# Altium schematic sheet FPGA_POWER.SchDoc (part 2 of 3)
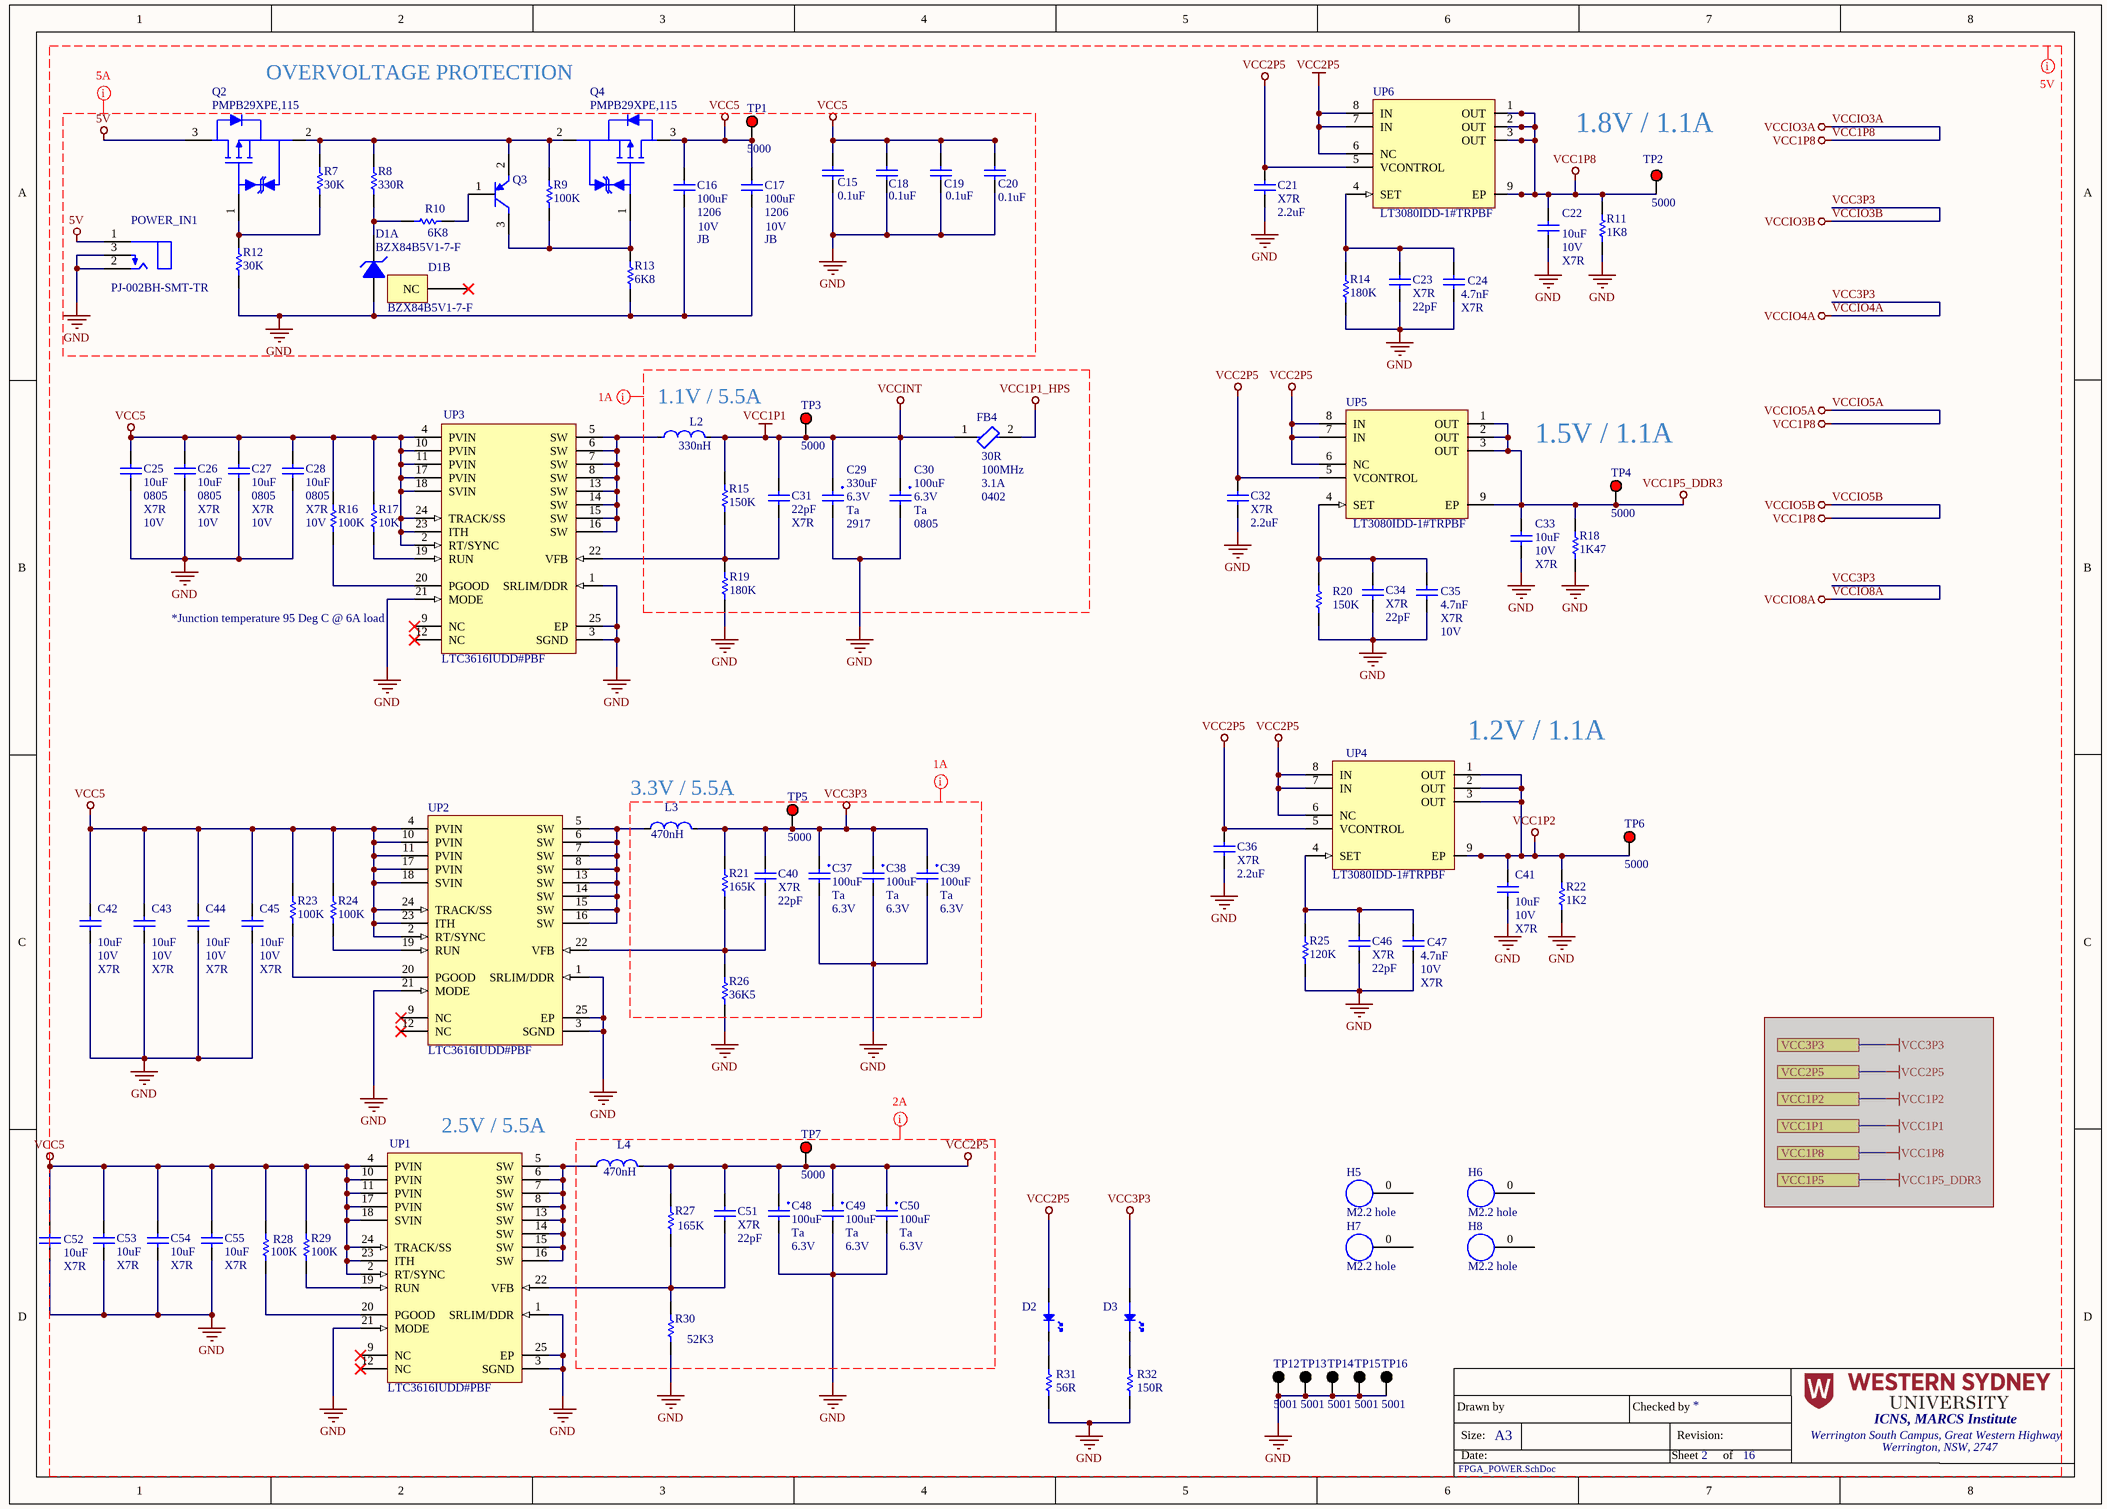
[diagram p1: FPGA_POWER.SchDoc]
## Library data of the parts
C15 C18-C20 = CMP-003-000005-1: Cap Ceramic 0.1uF 10V X7R 20% SMD 0402 125°C Paper T/R; Manufacturer 1: KEMET; Capacitance: 100nF; Dissipation Factor: 5%; Manufacturer Part Number 1: C0402C104M8RACTU; Stock 1: 32450; Pricing 1: 1=0.00400, 25=0.00400, 100=0.00400, 250=0.00400, 500=0.00400, 1000=0.00400 (USD); RoHS: Yes; Mount: Surface Mount; Case/Package: 0402; Case Code (Metric): 1005; Case Code (Imperial): 0402; Min Operating Temperature: -55°C; Max Operating Temperature: 125°C; Tolerance: 20%; Packaging: Tape and Reel; Package Quantity: 10000; Voltage Rating: 10V; Length: 1mm; Height: 0.5mm; Width: 0.02inch; Thickness: 0.022inch; Depth: 0.5mm; Radiation Hardening: No; ComponentLink1URL: https://datasheet.ciiva.com/26948/getdatasheetpartid-791262-26948427.pdf?src-supplier=Verical; ComponentLink1Description: https://datasheet.ciiva.com/26948/getdatasheetpartid-791262-26948427.pdf?src-supplier=Verical; Category: Ceramic Capacitors; Dielectric Material: Ceramic; Voltage Rating (DC): 10V; Dielectric: X7R; Termination: SMD/SMT; Series: C; RoHS Compliant: Yes; Source: ICNS_PropheseeLib.SchLib; Description 1: Cap Ceramic 0.1uF 10V X7R 20% SMD 0402 125°C Paper T/R; Lead Pitch: 0.3mm; Design Item ID: C0402C104M8RACTU
C16 C17 = CMP-003-000006-2: Cap Ceramic 100uF 10 V JB ±20 % Tolerance SMT 1206 Multilayer Ceramic Capacitor C Series; Manufacturer 1: TDK; Tolerance: 20%; Description 1: C Series 1206 100 uF 10 V ±20 % Tolerance JB SMT Multilayer Ceramic Capacitor; Manufacturer Part Number 1: C3216JB1A107M160AC; Stock 1: 4001; Pricing 1: 1=1.27730 (USD); RoHS: Yes; Mount: Surface Mount; Case Code (Imperial): 1206; Case Code (Metric): 3216; Dielectric Material: Ceramic; Min Operating Temperature: -25°C; Max Operating Temperature: 85°C; Packaging: Tape and Reel; Package Quantity: 2000; Capacitance: 100uF; Voltage Rating (DC): 10V; Termination: SMD/SMT; Resistor Type: Ceramic; Length: 0.126inch; Height: 1.6mm; Width: 0.063inch; Thickness: 0.069inch; Lead Free: Lead Free; ComponentLink1URL: https://datasheet.ciiva.com/14887/tdkmlcccaprange-14887077.pdf?src-supplier=Digi-Key; ComponentLink1Description: https://datasheet.ciiva.com/14887/tdkmlcccaprange-14887077.pdf?src-supplier=Digi-Key; ComponentLink2URL: https://datasheet.ciiva.com/14887/tdkmlcccaprange-14887078.pdf?src-supplier=Digi-Key; ComponentLink2Description: https://datasheet.ciiva.com/14887/tdkmlcccaprange-14887078.pdf?src-supplier=Digi-Key; ComponentLink3URL: https://datasheet.ciiva.com/14887/tdkmlcccaprange-14887079.pdf?src-supplier=Digi-Key; ComponentLink3Description: https://datasheet.ciiva.com/14887/tdkmlcccaprange-14887079.pdf?src-supplier=Digi-Key; Source: ICNS_PropheseeLib.SchLib; Category: Ceramic Capacitors; Design Item ID: C3216JB1A107M160AC; Series: C; RoHS Compliant: Yes
C21 C32 C36 = CMP-003-000007-1: Multilayer Ceramic Capacitor 0402 10V X7R 2.2uf 10%Tol paper; Manufacturer: Murata; Voltage Rating: 10V; Category: Ceramic Capacitors; Pricing: 1=0.24000, 10=0.16300, 50=0.09760, 100=0.08230, 500=0.05634, 1000=0.04984, 2500=0.04767, 5000=0.04334 (USD); Stock: 1230; RoHS Compliant: Yes; RoHS: Yes; Source: ICNS_PropheseeLib.SchLib; Case Code Imperial: 0402; Design Item ID: GRM155Z71A225KE01D; Manufacturer Part Number: GRM155Z71A225KE01D
C22 C25-C28 C33 C41-C45 = CMP-003-000011-1: Cap Multilayer Ceramic 10 uF 10 V X7R ±10 % 0805 Surface Mount Capacitor; Manufacturer: Murata; Tolerance: 10%; RoHS: Yes; Mount: Surface Mount; Case/Package: 0805; Weight: 0.000335oz; Case Code (Metric): 2012; Min Operating Temperature: -55°C; Max Operating Temperature: 125°C; Capacitance: 10uF; Packaging: Tape and Reel; Termination: SMD/SMT; Voltage Rating (DC): 10V; Package Quantity: 10000; Length: 0.079inch; Height: 1.25mm; Width: 1.25mm; Thickness: 0.055inch; ComponentLink1URL: http://www.mouser.com/ds/2/281/c03e-806517.pdf?src-supplier=Mouser; ComponentLink1Description: http://www.mouser.com/ds/2/281/c03e-806517.pdf?src-supplier=Mouser; Category: Ceramic Capacitors; Design Item ID: GCM21BR71A106KE22K; Ratings: AEC-Q200; ComponentLink3URL: http://search.murata.co.jp/Ceramy/image/img/A01X/partnumbering_e_02.pdf?src-supplier=Digi-Key; ComponentLink4Description: http://search.murata.co.jp/Ceramy/image/img/A01X/G101/ENG/GCM21BR71A106KE22-01.pdf?src-supplier=Digi-Key; RoHS Compliant: Yes; Manufacturer Part Number: GCM21BR71A106KE22K; ComponentLink2Description: https://search.murata.co.jp/Ceramy/image/img/A01X/G101/ENG/GCM21BR71A106KE22-01.pdf?src-supplier=Digi-Key; ComponentLink2URL: https://search.murata.co.jp/Ceramy/image/img/A01X/G101/ENG/GCM21BR71A106KE22-01.pdf?src-supplier=Digi-Key; Source: ICNS_PropheseeLib.SchLib; Pricing: 1=0.45000, 10=0.31600, 50=0.23880, 100=0.20790, 500=0.15400, 1000=0.13090, 2500=0.12320, 5000=0.11550 (USD); Stock: 4655; ComponentLink4URL: http://search.murata.co.jp/Ceramy/image/img/A01X/G101/ENG/GCM21BR71A106KE22-01.pdf?src-supplier=Digi-Key; ComponentLink3Description: http://search.murata.co.jp/Ceramy/image/img/A01X/partnumbering_e_02.pdf?src-supplier=Digi-Key
  C22 C33 C41-C45: Case Code (Imperial): 0805
C23 C31 C34 C40 C46 C51 = CMP-003-000033-1: Cap Ceramic 22pF 50V X7R 10% Pad SMD 0402 125C T/R; Manufacturer: KEMET; Capacitance: 22pF; Min Operating Temperature: -55°C; Voltage Rating (DC): 50V; Max Operating Temperature: 125°C; Packaging: Tape and Reel; Dielectric Material: Ceramic; Case/Package: 0402; Tolerance: 10%; RoHS Compliant: Yes; Termination: Wraparound; Length: 1mm; Depth: 0.5mm; Lead Free: Lead Free; Category: Ceramic Capacitors; Stock 1: 5829; Pricing 1: 1=0.18000, 10=0.12600, 25=0.10400, 50=0.08100, 100=0.05900 (USD); Manufacturer Part Number: C0402C220K5RACTU; Design Item ID: C0402C220K5RACTU; RoHS: Yes; Source: ICNS_PropheseeLib.SchLib
C24 C35 C47 = CMP-003-000003-1: Multilayer Ceramic Capacitor 0.0047uF 10V 10% 0402 Paper T/R; Manufacturer: Taiyo Yuden; RoHS: Yes; Capacitance: 4.7nF; Manufacturer Part Number: LMF105B7472KVHF; Case Code Imperial: 0402; Stock: 10371; Design Item ID: LMF105B7472KVHF; Category: Ceramic Capacitors; Pricing: 1=0.10000, 10=0.05600, 50=0.03040, 100=0.02480, 500=0.01772, 1000=0.01392, 2500=0.01265, 5000=0.01164 (USD); RoHS Compliant: Yes; Source: ICNS_PropheseeLib.SchLib
  C24: Voltage Rating: 10V
C29 = CMP-003-000008-1: Cap Tant Solid 330uF 6.3V D CASE 10% (7.3 X 4.3 X 2.8mm) SMD 7343-31 0.1 Ohm 125 C T/R; Manufacturer 1: KEMET; Tolerance: 20%; Life (Hours): 2000Hour; Ripple Current: 490mA; ESR (Equivalent Series Resistance): 100mR; Dissipation Factor: 8%; Leakage Current: 20.8uA; Dielectric Material: Tantalum; Polarity: Polar; Radiation Hardening: No; ComponentLink2Description: https://datasheet.ciiva.com/18096/getdatasheetpartid-131544-18096133.pdf?src-supplier=Verical; Width: 0.169inch; ComponentLink2URL: https://datasheet.ciiva.com/18096/getdatasheetpartid-131544-18096133.pdf?src-supplier=Verical; Case/Package: 7343-31; Length: 7.3mm; Package Quantity: 1; Max Operating Temperature: 125°C; Height: 2.8mm; ComponentLink1URL: https://datasheet.ciiva.com/3006/kem-t2009-t495-3006066.pdf?src-supplier=Avnet; Mount: Surface Mount,PCB; Packaging: Tape and Reel; Capacitance: 330uF; ComponentLink1Description: https://datasheet.ciiva.com/3006/kem-t2009-t495-3006066.pdf?src-supplier=Avnet; Min Operating Temperature: -55°C; ComponentLink4Description: https://datasheet.ciiva.com/22698/1881875-22698950.pdf?src-supplier=Element14; Voltage Rating (DC): 6.3V; Category: Tantalum Capacitors; Features: General Purpose; ComponentLink4URL: https://datasheet.ciiva.com/22698/1881875-22698950.pdf?src-supplier=Element14; RoHS: Yes; Lead Pitch: 3.8mm; ComponentLink3URL: https://datasheet.ciiva.com/14603/70095916-14603941.pdf?src-supplier=Allied+Electronics; Case Code (Metric): 7343; Stock 1: 2500; Series: T495; Pricing 1: 1=2.57000, 10=2.07900, 50=1.81480, 100=1.58790 (USD); Manufacturer Part Number 1: T495D337K006ATE100; Voltage: 6.3V; Lead Free: Lead Free; Description 1: Cap Tant Solid 330uF 6.3V D CASE 10% (7.3 X 4.3 X 2.8mm) SMD 7343-31 0.1 Ohm 125 C T/R; Height - Seated (Max): 0.122inch; Number of Pins: 2; Termination: SMD/SMT; REACH SVHC: No SVHC; Design Item ID: T495D337K006ATE100; Source: ICNS_PropheseeLib.SchLib; RoHS Compliant: Yes; Construction: Flat; ComponentLink3Description: https://datasheet.ciiva.com/14603/70095916-14603941.pdf?src-supplier=Allied+Electronics; Depth: 4.3mm
C30 C37-C39 C48-C50 = CMP-003-000001-2: Cap Tant Solid 100uF 6.3V R CASE 20% (2 X 1.35 X 1.35mm) SMD 2012-15 5 Ohm 125°C Plastic T/R; Manufacturer 1: Kyocera AVX; ESR (Equivalent Series Resistance): 5R; Leakage Current: 6uA; Manufacturer Part Number 1: TLCR107M006RTA; Stock 1: 3919; Pricing 1: 1=2.74000, 10=2.21400, 50=1.93200, 100=1.69050, 500=1.28800, 1000=1.12700 (USD); RoHS: Yes; Mount: Surface Mount; Case/Package: 0805; Case Code (Metric): 2012; Min Operating Temperature: -55°C; Max Operating Temperature: 125°C; Tolerance: 20%; Package Quantity: 1; Packaging: Tape and Reel; Voltage Rating (DC): 6.3V; Termination: SMD/SMT; Features: General Purpose; Length: 2mm; Height: 1.5mm; Width: 0.053inch; Height - Seated (Max): 0.059inch; Depth: 1.35mm; Radiation Hardening: No; Lead Free: Lead Free; ComponentLink1URL: https://datasheet.ciiva.com/16299/tantniob-16299237.pdf?src-supplier=Future+Electronics; ComponentLink1Description: https://datasheet.ciiva.com/16299/tantniob-16299237.pdf?src-supplier=Future+Electronics; ComponentLink2URL: https://datasheet.ciiva.com/17337/tlc-17337857.pdf?src-supplier=Avnet+Europe; ComponentLink2Description: https://datasheet.ciiva.com/17337/tlc-17337857.pdf?src-supplier=Avnet+Europe; ComponentLink3URL: https://datasheet.ciiva.com/264/tlc-264930.pdf?src-supplier=Digi-Key; ComponentLink3Description: https://datasheet.ciiva.com/264/tlc-264930.pdf?src-supplier=Digi-Key; ComponentLink4URL: https://datasheet.ciiva.com/264/tlc-264931.pdf?src-supplier=Digi-Key; ComponentLink4Description: https://datasheet.ciiva.com/264/tlc-264931.pdf?src-supplier=Digi-Key; ComponentLink5URL: https://datasheet.ciiva.com/264/tlc-264932.pdf?src-supplier=Digi-Key; ComponentLink5Description: https://datasheet.ciiva.com/264/tlc-264932.pdf?src-supplier=Digi-Key; ComponentLink6URL: https://datasheet.ciiva.com/12882/tlc-4380-12882614.pdf?src-supplier=Mouser; ComponentLink6Description: https://datasheet.ciiva.com/12882/tlc-4380-12882614.pdf?src-supplier=Mouser; Capacitance: 100uF; Category: Tantalum Capacitors; Series: TLC; Construction: Flat; RoHS Compliant: Yes; Source: ICNS_PropheseeLib.SchLib; Description 1: Cap Tant Solid 100uF 6.3V R CASE 20% (2 X 1.35 X 1.35mm) SMD 2012-15 5 Ohm 125°C Plastic T/R; Design Item ID: TLCR107M006RTA
  C37-C39 C48-C50: Case Code (Imperial): 0805
C52-C55 = CMP-003-000011-1: 0805 10 uF 10 V ±10 % Tolerance X7R Surface Mount Multilayer Ceramic Capacitor; Manufacturer: Murata; Tolerance: 10%; Voltage Rating (DC): 10V; Capacitance: 10uF; Case/Package: 0805; Case Code (Imperial): 0805; Case Code (Metric): 2012; ComponentLink1Description: http://www.mouser.com/ds/2/281/c03e-806517.pdf?src-supplier=Mouser; ComponentLink1URL: http://www.mouser.com/ds/2/281/c03e-806517.pdf?src-supplier=Mouser; ComponentLink2Description: https://search.murata.co.jp/Ceramy/image/img/A01X/G101/ENG/GCM21BR71A106KE22-01.pdf?src-supplier=Digi-Key; ComponentLink2URL: https://search.murata.co.jp/Ceramy/image/img/A01X/G101/ENG/GCM21BR71A106KE22-01.pdf?src-supplier=Digi-Key; ComponentLink3Description: http://search.murata.co.jp/Ceramy/image/img/A01X/partnumbering_e_02.pdf?src-supplier=Digi-Key; ComponentLink3URL: http://search.murata.co.jp/Ceramy/image/img/A01X/partnumbering_e_02.pdf?src-supplier=Digi-Key; ComponentLink4Description: http://search.murata.co.jp/Ceramy/image/img/A01X/G101/ENG/GCM21BR71A106KE22-01.pdf?src-supplier=Digi-Key; ComponentLink4URL: http://search.murata.co.jp/Ceramy/image/img/A01X/G101/ENG/GCM21BR71A106KE22-01.pdf?src-supplier=Digi-Key; Height: 1.25mm; Length: 0.079inch; Max Operating Temperature: 125°C; Min Operating Temperature: -55°C; Mount: Surface Mount; Packaging: Tape and Reel; RoHS: Yes; Thickness: 0.055inch; Voltage Rating: 10V; Width: 1.25mm; Category: Ceramic Capacitors; Design Item ID: GCM21BR71A106KE22K; Ratings: AEC-Q200; Weight: 0.000335oz; Package Quantity: 10000; RoHS Compliant: Yes; Manufacturer Part Number: GCM21BR71A106KE22K; Source: ICNS_PropheseeLib.SchLib; Pricing: 1=0.45000, 10=0.31600, 50=0.23880, 100=0.20790, 500=0.15400, 1000=0.13090, 2500=0.12320, 5000=0.11550 (USD); Stock: 4655; Termination: SMD/SMT
D1 = CMP-004-000015-1: Diode Zener Single 5.1V 2% 350mW 3-Pin SOT-23 T/R; Manufacturer: Diodes; Max Reverse Current: 2uA; Test Current: 5mA; Impedance: 60R; ESD Protection: No; Forward Voltage: 900mV; ComponentLink1URL: https://datasheet.ciiva.com/30478/0900766b81268ba3-30478627.pdf?src-supplier=RSComponents; ComponentLink1Description: https://datasheet.ciiva.com/30478/0900766b81268ba3-30478627.pdf?src-supplier=RSComponents; RoHS: Yes; Mount: Surface Mount; Max Operating Temperature: 150°C; Max Power Dissipation: 350mW; Packaging: Tape and Reel; Tolerance: 2%; Case/Package: SOT-23; Package Quantity: 3000; Voltage Tolerance: 2%; REACH SVHC: No SVHC; Zener Voltage: 5.1V; Design Item ID: BZX84B5V1-7-F; Source: ICNS_PropheseeLib.SchLib; Max Reverse Leakage Current: 2uA; Category: Zener Diodes; Min Operating Temperature: -65°C; Element Configuration: Single; Number of Pins: 3; Weight: 0.00031oz; RoHS Compliant: Yes; Stock 1: 223; Contact Plating: Tin,Matte; Pricing 1: 1=0.17220, 10=0.16360, 25=0.16120, 100=0.09210 (USD); Lead Free: Lead Free; Power Rating: 350mW; Length: 2.9mm; Termination: SMD/SMT; Height: 1mm; Diode Type: ZENER; Zener Current: 2uA; Series: -; Manufacturer Part Number: BZX84B5V1-7-F; Width: 2.4mm
D2 D3 = CMP-004-000014-1: Led, Red, 630 Nm, 1.9 V, 20mA, 30 Ma, 60 Mcd Rohs Compliant: Yes; Manufacturer 1: Wurth Electronics; Wavelength: 630nm; Forward Voltage: 1.9V; Forward Current: 30mA; Lens Style: Clear,Rectangular; Luminous Intensity: 60mcd; Viewing Angle: 140°; Description 1: Led, Red, 630 Nm, 1.9 V, 30 Ma, 60 Mcd Rohs Compliant: Yes; Case/Package: 0603; Case Code (Metric): 1608; Width: 0.8mm; Height: 0.7mm; Case Code (Imperial): 0603; Min Operating Temperature: -40°C; Mount: Surface Mount; REACH SVHC: Unknown; Packaging: Tape and Reel; Color: Red; Test Current: 20mA; Max Operating Temperature: 85°C; Package Quantity: 4000; Dominant Wavelength: 630nm; Length: 1.6mm; RoHS Compliant: Yes; ComponentLink3Description: https://datasheet.ciiva.com/48430/150060ss75000-eng-tds-48430042.pdf?src-supplier=Distrelec; RoHS: Yes; Stock 1: 25645; Source: ICNS_PropheseeLib.SchLib; ComponentLink2Description: https://datasheet.ciiva.com/29279/759429-da-01-en-chipled-0603-w-kl-s-rot-150060ss75000-29279208.pdf?src-supplier=Conrad; ComponentLink1URL: https://datasheet.ciiva.com/23843/150060ss75000-23843248.pdf?src-supplier=Newark; Category: LEDs; ComponentLink3URL: https://datasheet.ciiva.com/48430/150060ss75000-eng-tds-48430042.pdf?src-supplier=Distrelec; ComponentLink1Description: https://datasheet.ciiva.com/23843/150060ss75000-23843248.pdf?src-supplier=Newark; Pricing 1: 1=0.15000, 50=0.13800, 100=0.11800, 500=0.10200 (USD); Design Item ID: 150060SS75000; ComponentLink2URL: https://datasheet.ciiva.com/29279/759429-da-01-en-chipled-0603-w-kl-s-rot-150060ss75000-29279208.pdf?src-supplier=Conrad; Manufacturer Part Number 1: 150060SS75000
FB4 = CMP-005-000017-1: Ferrite Beads Multi-Layer 30Ohm 25% 100MHz 3.1A 0.017Ohm DCR 0402 T/R; Manufacturer: Murata; Number of Lines: 1; DC Resistance (DCR): 17mR; Case Code (Metric): 1005; RoHS: Yes; Case/Package: 0402; ComponentLink1URL: https://www.murata.com/en-us/products/productdata/8796740059166/ENFA0018.pdf?src-supplier=Digi-Key; Source: ICNS_PropheseeLib.SchLib; Stock 1: 9104; Mount: Surface Mount; Max Operating Temperature: 125°C; Pricing 1: 1=0.11210, 10=0.07210, 100=0.04290, 500=0.04030, 10000=0.03340 (USD); Design Item ID: BLM15KD300SN1D; Min Operating Temperature: -55°C; Category: Ferrite Beads and Chips; Packaging: Cut Tape; RoHS Compliant: Yes; ComponentLink1Description: https://www.murata.com/en-us/products/productdata/8796740059166/ENFA0018.pdf?src-supplier=Digi-Key; Manufacturer Part Number: BLM15KD300SN1D
H5-H8 = CMP-019-000000-1: M2.2 through hole not plated; Source: ICNS_PropheseeLib.SchLib; Design Item ID: M2.2 hole
L2 = CMP-006-00022-1: Inductor High Current Shielded Wirewound 330nH 20% 100KHz 20A 3.9mOhm DCR 2525 T/R; DC Resistance (DCR): 3.9mR; Max DC Current: 30A; Self Resonant Frequency: 5MHz; Case/Package: 2525; Current Rating: 20A; Depth: 6.72mm; Height - Seated (Max): 0.118inch; Height: 3mm; Inductance: 330nH; Inductance Tolerance: 20%; Lead Free: Lead Free; Length: 6.86mm; Max Operating Temperature: 125°C; Min Operating Temperature: -55°C; Mount: Surface Mount; Number of Pins: 2; Package Quantity: 2000; Packaging: Tape and Reel; Radiation Hardening: No; REACH SVHC: Unknown; RMS Current (Irms): 20A; Saturation Current: 30A; Shielding: Shielded; Termination: SMD/SMT; Test Frequency: 100kHz; Tolerance: 20%; Width: 0.255inch; Case Code (Metric): 6363; Case Code (Imperial): 2525; Military Standard: Not; Series: IHLP-2525CZ-01; Rated Current-Max: 20A
L3 L4 = CMP-005-000001-1: Power Choke Shielded Wirewound 0.47uH 20% 100KHz Powdered Iron 17.5A 0.0042Ohm DCR 2525 T/R; Manufacturer 1: Vishay; DC Resistance (DCR): 4.2mR; Saturation Current: 26A; Self Resonant Frequency: 75MHz; Max Operating Temperature: 125°C; Shielding: Shielded; Tolerance: 20%; Inductance: 470nH; Current Rating: 17.5A; Min Operating Temperature: -55°C; Test Frequency: 100kHz; Mount: Surface Mount; Manufacturer Part Number 1: IHLP2525CZETR47M01; Source: ICNS_PropheseeLib.SchLib; Design Item ID: IHLP2525CZETR47M01; Description 1: Power Choke Shielded Wirewound 0.47uH 20% 100KHz Powdered Iron 17.5A 0.0042Ohm DCR 2525 T/R; Category: Fixed Inductors; Number of Pins: 2; Stock 1: 914; Inductance Tolerance: 20%; RoHS: Yes; Pricing 1: 1=1.31000, 10=1.21600, 25=1.12200, 50=0.93500, 100=0.87890, 250=0.78540, 500=0.67320 (USD)
POWER_IN1 = CMP-010-000001-1: Power Barrel Connector Jack 2.50mm ID (0.098"), 5.50mm OD (0.217") Surface Mount, Right Angle; Manufacturer: CUI; Shielding: Unshielded; Insulation Resistance: 100MR; Gender: Male; Voltage Rating: 24V; Number of Conductors: 2; Current Rating: 5A; Manufacturer Part Number: PJ-002BH-SMT-TR; Housing Material: Thermoplastic; Design Item ID: PJ-002BH-SMT-TR; Color: Black; Lead Free: Lead Free; Source: ICNS_PropheseeLib.SchLib; Packaging: Tape and Reel; RoHS: Yes; Category: Connectors; ComponentLink1URL: https://datasheet.ciiva.com/7359/pj-002bh-smt-7359045.pdf?src-supplier=Digi-Key; Connector Type: Jack; ComponentLink3URL: https://datasheet.ciiva.com/16478/pj-002bh-16478074.pdf?src-supplier=Future+Electronics; Package Quantity: 350; Mount: Surface Mount; ComponentLink3Description: https://datasheet.ciiva.com/16478/pj-002bh-16478074.pdf?src-supplier=Future+Electronics; Contact Gender: Male; Min Operating Temperature: -25°C; Contact Material: Copper Alloy,Brass; Series: -; Termination: SMD/SMT; Orientation: Horizontal; Housing Color: Black; Max Operating Temperature: 85°C; Flammability Rating: UL94 V-0; ComponentLink1Description: https://datasheet.ciiva.com/7359/pj-002bh-smt-7359045.pdf?src-supplier=Digi-Key; ComponentLink2Description: https://datasheet.ciiva.com/7359/pj-002bh-smt-7359048.pdf?src-supplier=Digi-Key; ComponentLink2URL: https://datasheet.ciiva.com/7359/pj-002bh-smt-7359048.pdf?src-supplier=Digi-Key; Contact Plating: Nickel
Q2 Q4 = CMP-008-000015-1: PMPB29XPE - 20 V, single P-channel Trench MOSFET; Manufacturer: Nexperia; RoHS Compliant: Yes; Source: ICNS_PropheseeLib.SchLib; Stock 1: 942; RoHS: Yes; Design Item ID: PMPB29XPE,115; Manufacturer Part Number: PMPB29XPE,115; Category: MOSFETs; Pricing 1: 1=0.45000, 10=0.38100, 100=0.28460, 500=0.22360, 1000=0.17279 (USD)
Q3 = CMP-007-000000-1: TRANS PNP 25V 1.5A SOT23; Manufacturer 1: MCC; Element Configuration: Single; Gain Bandwidth Product: 100MHz; Collector Emitter Voltage (VCEO): 500mV; hFE Min: 40; Max Power Dissipation: 625mW; Collector Base Voltage (VCBO): 40V; Emitter Base Voltage (VEBO): 1.6V; Manufacturer Part Number 1: MMSS8550-H-TP; Stock 1: 17326; Pricing 1: 1=0.20000, 10=0.17800, 100=0.09700, 500=0.05970, 1000=0.04070 (USD); RoHS: Yes; Mount: Surface Mount; Case/Package: SOT-23; Min Operating Temperature: -55°C; Max Operating Temperature: 150°C; Package Quantity: 1; Packaging: Tape and Reel; Max Collector Current: 1.5A; Transition Frequency: 100MHz; Collector Emitter Breakdown Voltage: 25V; Max Breakdown Voltage: 25V; Polarity: PNP; Collector Emitter Saturation Voltage: 500mV; Lead Free: Lead Free; ComponentLink1URL: https://datasheet.ciiva.com/16285/mmss8550sot-23-12703-16285519.pdf?src-supplier=Mouser; ComponentLink1Description: https://datasheet.ciiva.com/16285/mmss8550sot-23-12703-16285519.pdf?src-supplier=Mouser; ComponentLink2URL: https://datasheet.ciiva.com/17380/mmss8550sot-23-17380226.pdf?src-supplier=Future+Electronics; ComponentLink2Description: https://datasheet.ciiva.com/17380/mmss8550sot-23-17380226.pdf?src-supplier=Future+Electronics; ComponentLink3URL: https://datasheet.ciiva.com/6356/mmss8550sot-23-6356925.pdf?src-supplier=Digi-Key; ComponentLink3Description: https://datasheet.ciiva.com/6356/mmss8550sot-23-6356925.pdf?src-supplier=Digi-Key; ComponentLink4URL: https://datasheet.ciiva.com/6356/mmss8550sot-23-6356926.pdf?src-supplier=Digi-Key; ComponentLink4Description: https://datasheet.ciiva.com/6356/mmss8550sot-23-6356926.pdf?src-supplier=Digi-Key; ComponentLink5URL: https://datasheet.ciiva.com/6356/mmss8550sot-23-6356927.pdf?src-supplier=Digi-Key; ComponentLink5Description: https://datasheet.ciiva.com/6356/mmss8550sot-23-6356927.pdf?src-supplier=Digi-Key; Description 1: TRANS PNP 25V 1.5A SOT23; Source: ICNS_PropheseeLib.SchLib; Collector-emitter Voltage-Max: 500mV; Series: -; RoHS Compliant: Yes; Design Item ID: MMSS8550-H-TP; Category: BJTs
R7 R12 = CMP-006-000002-1: Res Thick Film 0402 30K Ohm 1% 0.2W(1/5W) ±100ppm/°C Chip Resistor Automotive AEC-Q200, Pulse Withstanding; Manufacturer 1: Vishay Dale; Max Power Dissipation: 200mW; Resistance: 30kR; Description 1: RES SMD 30K OHM 1% 1/5W 0402; RoHS: Yes; Case/Package: 0402; Min Operating Temperature: -55°C; Max Operating Temperature: 155°C; Tolerance: 1%; Number of Terminations: 2; Temperature Coefficient: 100ppm/°C; Width: 0.02inch; ComponentLink1URL: http://www.vishay.com/docs/20065/rcse3.pdf?src-supplier=Digi-Key; ComponentLink1Description: http://www.vishay.com/docs/20065/rcse3.pdf?src-supplier=Digi-Key; Manufacturer Part Number 1: RCS040230K0FKED; Stock 1: 1812; Pricing 1: 1=0.12000, 10=0.10500, 100=0.04020, 1000=0.01771, 2500=0.01530, 5000=0.01368 (USD); Packaging: Tape and Reel; Length: 0.039inch; Features: Automotive AEC-Q200; Height: 0.016inch; Package Quantity: 10000; Source: ICNS_PropheseeLib.SchLib; Resistor Type: Thick Film; Design Item ID: RCS040230K0FKED; Category: Chip SMD Resistors; RoHS Compliant: Yes
R8 = CMP-006-000013-1: Res Thick Film 0402 330 Ohm 1% 0.2W ±100ppm/°C Molded SMD SMD Paper T/R; Manufacturer 1: Vishay Dale; Max Power Dissipation: 200mW; Voltage Rating (DC): 50V; Power Rating: 125mW; RoHS: Yes; Mount: Surface Mount; Case/Package: 0402; Case Code (Metric): 1005; Case Code (Imperial): 0402; Min Operating Temperature: -55°C; Max Operating Temperature: 155°C; Tolerance: 1%; Number of Terminations: 2; Temperature Coefficient: 100ppm/°C; Width: 0.02inch; ComponentLink1URL: https://datasheet.ciiva.com/2573/crcwhpe3-2573979.pdf?src-supplier=Digi-Key; ComponentLink1Description: https://datasheet.ciiva.com/2573/crcwhpe3-2573979.pdf?src-supplier=Digi-Key; ComponentLink2URL: https://datasheet.ciiva.com/8944/crcwhpe3-8944953.pdf?src-supplier=Avnet; ComponentLink2Description: https://datasheet.ciiva.com/8944/crcwhpe3-8944953.pdf?src-supplier=Avnet; Manufacturer Part Number 1: CRCW0402330RFKEDHP; Stock 1: 5573; Pricing 1: 10000=0.01543 (USD); Number of Pins: 2; Resistance: 330R; Voltage Rating: 50V; Packaging: Tape and Reel; Package Quantity: 10000; Termination: SMD/SMT; Features: Automotive AEC-Q200; Length: 1mm; Height: 0.016inch; Depth: 0.5mm; REACH SVHC: Unknown; Lead Free: Lead Free; Contact Plating: Tin; Military Standard: Not; Radiation Hardening: No; Resistance Tolerance: 1%; Category: Chip SMD Resistors; Design Item ID: CRCW0402330RFKEDHP; Series: CRCW-HP; Technology: THICK FILM; Construction: Rectangular; Resistor Type: Thick Film; Description 1: Res Thick Film 0402 330 Ohm 1% 0.2W ±100ppm/°C Molded SMD SMD Paper T/R; RoHS Compliant: Yes; Source: ICNS_PropheseeLib.SchLib
R9 R16 R23 R24 R28 R29 = CMP-006-000009-1: Res Thick Film 0402 100K Ohm 1% 0.2W(1/5W) ±100ppm/C Pad SMD Automotive T/R; Manufacturer 1: Vishay Dale; Max Power Dissipation: 125mW; Temperature Coefficient: 100ppm/°C; Resistance: 100kR; Voltage Rating: 50V; RoHS: Yes; Mount: Surface Mount; Case/Package: 0402; Case Code (Metric): 1005; Case Code (Imperial): 0402; Min Operating Temperature: -55°C; Max Operating Temperature: 155°C; Tolerance: 1%; Number of Terminations: 2; Width: 0.02inch; ComponentLink1URL: https://datasheet.ciiva.com/2498/crcwhpe3-2498716.pdf?src-supplier=Digi-Key; ComponentLink1Description: https://datasheet.ciiva.com/2498/crcwhpe3-2498716.pdf?src-supplier=Digi-Key; ComponentLink2URL: https://datasheet.ciiva.com/2498/crcwhpe3-2498717.pdf?src-supplier=Digi-Key; ComponentLink2Description: https://datasheet.ciiva.com/2498/crcwhpe3-2498717.pdf?src-supplier=Digi-Key; ComponentLink3URL: https://datasheet.ciiva.com/2498/crcwhpe3-2498718.pdf?src-supplier=Digi-Key; ComponentLink3Description: https://datasheet.ciiva.com/2498/crcwhpe3-2498718.pdf?src-supplier=Digi-Key; Manufacturer Part Number 1: CRCW0402100KFKEDHP; Stock 1: 96553; Pricing 1: 10000=0.01543 (USD); Weight: 2.3E-05oz; Contact Plating: Tin; Features: Automotive AEC-Q200; Power Rating: 125mW; Packaging: Tape and Reel; Package Quantity: 10; Termination: SMD/SMT; Voltage Rating (DC): 50V; Length: 1mm; Height: 0.3mm; Depth: 0.5mm; Radiation Hardening: No; REACH SVHC: Unknown; Lead Free: Lead Free; ComponentLink4URL: https://datasheet.ciiva.com/8982/crcwhpe3-8982553.pdf?src-supplier=Avnet; ComponentLink4Description: https://datasheet.ciiva.com/8982/crcwhpe3-8982553.pdf?src-supplier=Avnet; ComponentLink5URL: https://datasheet.ciiva.com/48525/crcwhpe3-48525582.pdf?src-supplier=Avnet; ComponentLink5Description: https://datasheet.ciiva.com/48525/crcwhpe3-48525582.pdf?src-supplier=Avnet; ComponentLink6URL: https://datasheet.ciiva.com/5548/crcwhpe3-46056-5548557.pdf?src-supplier=Mouser; ComponentLink6Description: https://datasheet.ciiva.com/5548/crcwhpe3-46056-5548557.pdf?src-supplier=Mouser; ComponentLink7URL: https://datasheet.ciiva.com/46441/1703058-46441599.pdf?src-supplier=Element14; ComponentLink7Description: https://datasheet.ciiva.com/46441/1703058-46441599.pdf?src-supplier=Element14; Series: CRCW-HP; RoHS Compliant: Yes; Design Item ID: CRCW0402100KFKEDHP; Resistor Type: Thick Film; Resistance Tolerance: 1%; Description 1: Res Thick Film 0402 100K Ohm 1% 0.2W(1/5W) ±100ppm/C Pad SMD Automotive T/R; Source: ICNS_PropheseeLib.SchLib; Category: Chip SMD Resistors; Technology: THICK FILM
R10 R13 = CMP-006-000014-1: Res Thick Film 0402 6.8K Ohm 1% 0.2W(1/5W) ±100ppm/°C Pad SMD Automotive T/R; Manufacturer 1: Vishay Dale; Max Power Dissipation: 200mW; Voltage Rating (DC): 50V; Power Rating: 125mW; Resistance: 6.8kR; RoHS: Yes; Mount: Surface Mount; Case/Package: 0402; Case Code (Metric): 1005; Case Code (Imperial): 0402; Min Operating Temperature: -55°C; Max Operating Temperature: 155°C; Tolerance: 1%; Number of Terminations: 2; Temperature Coefficient: 100ppm/°C; Width: 0.02inch; ComponentLink1URL: https://datasheet.ciiva.com/2527/crcwhpe3-2527060.pdf?src-supplier=Digi-Key; ComponentLink1Description: https://datasheet.ciiva.com/2527/crcwhpe3-2527060.pdf?src-supplier=Digi-Key; ComponentLink2URL: https://datasheet.ciiva.com/2527/crcwhpe3-2527061.pdf?src-supplier=Digi-Key; ComponentLink2Description: https://datasheet.ciiva.com/2527/crcwhpe3-2527061.pdf?src-supplier=Digi-Key; ComponentLink3URL: https://datasheet.ciiva.com/2527/crcwhpe3-2527062.pdf?src-supplier=Digi-Key; ComponentLink3Description: https://datasheet.ciiva.com/2527/crcwhpe3-2527062.pdf?src-supplier=Digi-Key; Manufacturer Part Number 1: CRCW04026K80FKEDHP; Stock 1: 5018; Pricing 1: 1=0.15000, 10=0.13200, 100=0.05060, 1000=0.02226, 2500=0.01923, 5000=0.01720 (USD); Voltage Rating: 50V; Termination: SMD/SMT; Packaging: Cut Tape; Military Standard: Not; Package Quantity: 10000; Features: Automotive AEC-Q200; Length: 1mm; Height: 0.016inch; Depth: 0.5mm; REACH SVHC: Unknown; Lead Free: Lead Free; Category: Chip SMD Resistors; Description 1: Res Thick Film 0402 6.8K Ohm 1% 0.2W(1/5W) ±100ppm/°C Pad SMD Automotive T/R; Series: CRCW-HP; Resistance Tolerance: 1%; Technology: THICK FILM; Contact Plating: Tin; Design Item ID: CRCW04026K80FKEDHP; Construction: Rectangular; Number of Pins: 2; Resistor Type: Thick Film; Source: ICNS_PropheseeLib.SchLib; RoHS Compliant: Yes
R11 = CMP-006-000012-1: Res Thick Film 0402 1.8K Ohm 1% 0.2W(1/5W) ±100ppm/°C Pad SMD Automotive T/R; Manufacturer 1: Vishay Dale; Max Power Dissipation: 200mW; Resistance: 1.8kR; Power Rating: 125mW; Voltage Rating: 50V; RoHS: Yes; Mount: Surface Mount; Case/Package: 0402; Case Code (Metric): 1005; Case Code (Imperial): 0402; Min Operating Temperature: -55°C; Max Operating Temperature: 155°C; Tolerance: 1%; Number of Terminations: 2; Temperature Coefficient: 100ppm/°C; Width: 0.02inch; ComponentLink1URL: https://datasheet.ciiva.com/2573/crcwhpe3-2573155.pdf?src-supplier=Digi-Key; ComponentLink1Description: https://datasheet.ciiva.com/2573/crcwhpe3-2573155.pdf?src-supplier=Digi-Key; ComponentLink2URL: https://datasheet.ciiva.com/28420/crcwhpe3-28420126.pdf?src-supplier=Avnet+Europe; ComponentLink2Description: https://datasheet.ciiva.com/28420/crcwhpe3-28420126.pdf?src-supplier=Avnet+Europe; Manufacturer Part Number 1: CRCW04021K80FKEDHP; Stock 1: 10000; Pricing 1: 1=0.15000, 10=0.13200, 100=0.05060, 1000=0.02226, 2500=0.01923, 5000=0.01720 (USD); Contact Plating: Tin; Package Quantity: 10000; Packaging: Tape and Reel; Termination: SMD/SMT; Features: Automotive AEC-Q200; Military Standard: Not; Length: 1mm; Height: 0.016inch; Depth: 0.5mm; Radiation Hardening: No; Lead Free: Lead Free; Resistor Type: Thick Film; REACH SVHC: Unknown; Category: Chip SMD Resistors; Technology: THICK FILM; Voltage Rating (DC): 50V; Resistance Tolerance: 1%; Source: ICNS_PropheseeLib.SchLib; Construction: Rectangular; Description 1: Res Thick Film 0402 1.8K Ohm 1% 0.2W(1/5W) ±100ppm/°C Pad SMD Automotive T/R; Series: CRCW-HP; Number of Pins: 2; Design Item ID: CRCW04021K80FKEDHP; RoHS Compliant: Yes
R14 R19 = CMP-006-000001-1: Res Thick Film 0402 180K Ohm 1% 0.2W(1/5W) ±100ppm/°C Chip Resistor Automotive AEC-Q200, Pulse Withstanding; Manufacturer 1: Vishay Dale; Max Power Dissipation: 200mW; Resistance: 180kR; Description 1: RES SMD 180K OHM 1% 1/5W 0402; RoHS: Yes; Case/Package: 0402; Min Operating Temperature: -55°C; Max Operating Temperature: 155°C; Tolerance: 1%; Number of Terminations: 2; Temperature Coefficient: 100ppm/°C; Width: 0.02inch; ComponentLink1URL: http://www.vishay.com/docs/20065/rcse3.pdf?src-supplier=Digi-Key; ComponentLink1Description: http://www.vishay.com/docs/20065/rcse3.pdf?src-supplier=Digi-Key; Manufacturer Part Number 1: RCS0402180KFKED; Stock 1: 6251; Pricing 1: 1=0.12000, 10=0.10500, 100=0.04020, 1000=0.01771, 2500=0.01530, 5000=0.01368 (USD); Features: Automotive AEC-Q200; Package Quantity: 10000; Packaging: Tape and Reel; Length: 0.039inch; Height: 0.016inch; Resistor Type: Thick Film; Source: ICNS_PropheseeLib.SchLib; Design Item ID: RCS0402180KFKED; Category: Chip SMD Resistors; RoHS Compliant: Yes
R15 = CMP-006-000006-1: Res Thick Film 0402 150K Ohm 1% 1/16W ±100ppm/°C Molded SMD SMD Paper T/R; Manufacturer 1: Vishay; Max Power Dissipation: 63mW; Voltage Rating: 50V; Resistance: 150kR; RoHS: Yes; Mount: Surface Mount; Case/Package: 0402; Case Code (Metric): 1005; Case Code (Imperial): 0402; Min Operating Temperature: -55°C; Max Operating Temperature: 155°C; Tolerance: 1%; Number of Terminations: 2; Temperature Coefficient: 100ppm/°C; Width: 0.02inch; ComponentLink1URL: https://datasheet.ciiva.com/11809/0900766b80d98824-11809905.pdf?src-supplier=RSComponents; ComponentLink1Description: https://datasheet.ciiva.com/11809/0900766b80d98824-11809905.pdf?src-supplier=RSComponents; ComponentLink2URL: https://datasheet.ciiva.com/5545/dcrcwe3-109170-5545413.pdf?src-supplier=Mouser; ComponentLink2Description: https://datasheet.ciiva.com/5545/dcrcwe3-109170-5545413.pdf?src-supplier=Mouser; ComponentLink3URL: https://datasheet.ciiva.com/2463/dcrcwe3-2463136.pdf?src-supplier=Digi-Key; ComponentLink3Description: https://datasheet.ciiva.com/2463/dcrcwe3-2463136.pdf?src-supplier=Digi-Key; Manufacturer Part Number 1: CRCW0402150KFKED; Stock 1: 2100; Pricing 1: 50=0.06100, 500=0.05700, 1000=0.05100, 2000=0.04500, 4000=0.03900 (USD); Weight: 2.3E-05oz; Contact Plating: Tin; Packaging: Tape and Reel; Package Quantity: 10; Power Rating: 63mW; Termination: SMD/SMT; Military Standard: Not; Voltage Rating (DC): 50V; Features: Automotive AEC-Q200; Length: 1mm; Height: 0.35mm; Depth: 0.5mm; Radiation Hardening: No; REACH SVHC: Unknown; Lead Free: Lead Free; ComponentLink4URL: https://datasheet.ciiva.com/2463/dcrcwe3-2463137.pdf?src-supplier=Digi-Key; ComponentLink4Description: https://datasheet.ciiva.com/2463/dcrcwe3-2463137.pdf?src-supplier=Digi-Key; ComponentLink5URL: https://datasheet.ciiva.com/2463/dcrcwe3-2463138.pdf?src-supplier=Digi-Key; ComponentLink5Description: https://datasheet.ciiva.com/2463/dcrcwe3-2463138.pdf?src-supplier=Digi-Key; ComponentLink6URL: https://datasheet.ciiva.com/8336/dcrcwe3-8336669.pdf?src-supplier=Avnet; ComponentLink6Description: https://datasheet.ciiva.com/8336/dcrcwe3-8336669.pdf?src-supplier=Avnet; ComponentLink7URL: https://datasheet.ciiva.com/16207/dcrcwe3-16207433.pdf?src-supplier=Future+Electronics; ComponentLink7Description: https://datasheet.ciiva.com/16207/dcrcwe3-16207433.pdf?src-supplier=Future+Electronics; ComponentLink8URL: https://datasheet.ciiva.com/26316/fld-crcw-e3-data-en-26316632.pdf?src-supplier=Distrelec; ComponentLink8Description: https://datasheet.ciiva.com/26316/fld-crcw-e3-data-en-26316632.pdf?src-supplier=Distrelec; RoHS Compliant: Yes; Resistance Tolerance: 1%; Resistor Type: Thick Film; Description 1: Res Thick Film 0402 150K Ohm 1% 1/16W ±100ppm/°C Molded SMD SMD Paper T/R; Series: CRCW; Construction: Rectangular; Category: Chip SMD Resistors; Design Item ID: CRCW0402150KFKED; Working Voltage: 50V; Source: ICNS_PropheseeLib.SchLib; Technology: THICK FILM
R17 = CMP-006-000000-1: Res Thick Film 0402 10K Ohm 1% 0.2W(1/5W) ±100ppm/°C Pad SMD Automotive Medical T/R; Manufacturer 1: Vishay Dale; Max Power Dissipation: 200mW; Resistance: 10kR; RoHS: Yes; Case/Package: 0402; Case Code (Metric): 1005; Case Code (Imperial): 0402; Min Operating Temperature: -55°C; Max Operating Temperature: 155°C; Tolerance: 1%; Number of Terminations: 2; Temperature Coefficient: 100ppm/°C; Width: 0.02inch; ComponentLink1URL: http://www.farnell.com/datasheets/2869616.pdf?src-supplier=Farnell; ComponentLink1Description: http://www.farnell.com/datasheets/2869616.pdf?src-supplier=Farnell; ComponentLink2URL: http://www.vishay.com/docs/20065/rcse3.pdf?src-supplier=Digi-Key; ComponentLink2Description: http://www.vishay.com/docs/20065/rcse3.pdf?src-supplier=Digi-Key; ComponentLink3URL: http://www.farnell.com/datasheets/2869616.pdf?src-supplier=Newark; ComponentLink3Description: http://www.farnell.com/datasheets/2869616.pdf?src-supplier=Newark; Manufacturer Part Number 1: RCS040210K0FKED; Stock 1: 6361; Pricing 1: 1=0.12000, 10=0.10500, 100=0.04020, 1000=0.01771, 2500=0.01530, 5000=0.01368 (USD); Features: Automotive AEC-Q200; Packaging: Tape and Reel; Length: 0.039inch; Height: 0.016inch; Description 1: Res Thick Film 0402 10K Ohm 1% 0.2W(1/5W) ±100ppm/°C Pad SMD Automotive Medical T/R; Resistor Type: Thick Film; Design Item ID: RCS040210K0FKED; Source: ICNS_PropheseeLib.SchLib; Category: Chip SMD Resistors
R18 = CMP-006-000007-1: Res Thick Film 0402 1.47K Ohm 1% 1/16W ±100ppm/°C Molded SMD SMD Paper T/R; Manufacturer 1: Vishay; Max Power Dissipation: 63mW; Resistance: 1.47kR; Voltage Rating: 50V; RoHS: Yes; Case/Package: 0402; Case Code (Metric): 1005; Case Code (Imperial): 0402; Min Operating Temperature: -55°C; Max Operating Temperature: 155°C; Tolerance: 1%; Number of Terminations: 2; Temperature Coefficient: 100ppm/°C; Width: 0.5mm; ComponentLink1URL: https://datasheet.ciiva.com/11818/0900766b80d98824-11818002.pdf?src-supplier=RSComponents; ComponentLink1Description: https://datasheet.ciiva.com/11818/0900766b80d98824-11818002.pdf?src-supplier=RSComponents; ComponentLink2URL: https://datasheet.ciiva.com/3256/dcrcwe3-3256169.pdf?src-supplier=Avnet; ComponentLink2Description: https://datasheet.ciiva.com/3256/dcrcwe3-3256169.pdf?src-supplier=Avnet; ComponentLink3URL: https://datasheet.ciiva.com/5546/dcrcwe3-109170-5546826.pdf?src-supplier=Mouser; ComponentLink3Description: https://datasheet.ciiva.com/5546/dcrcwe3-109170-5546826.pdf?src-supplier=Mouser; Manufacturer Part Number 1: CRCW04021K47FKED; Stock 1: 7200; Pricing 1: 1=0.10000, 10=0.03800, 100=0.01530, 1000=0.00686, 2500=0.00595, 5000=0.00492 (USD); Weight: 2.3E-05oz; Contact Plating: Tin; Package Quantity: 10000; Power Rating: 63mW; Packaging: Tape and Reel; Termination: SMD/SMT; Features: Automotive AEC-Q200; Military Standard: Not; Length: 1mm; Height: 0.35mm; Depth: 0.5mm; Radiation Hardening: No; Lead Free: Lead Free; ComponentLink4URL: https://datasheet.ciiva.com/16208/dcrcwe3-16208442.pdf?src-supplier=Future+Electronics; ComponentLink4Description: https://datasheet.ciiva.com/16208/dcrcwe3-16208442.pdf?src-supplier=Future+Electronics; ComponentLink5URL: https://datasheet.ciiva.com/16881/dcrcwe3-16881128.pdf?src-supplier=Avnet+Europe; ComponentLink5Description: https://datasheet.ciiva.com/16881/dcrcwe3-16881128.pdf?src-supplier=Avnet+Europe; ComponentLink6URL: https://datasheet.ciiva.com/22869/70201119-22869005.pdf?src-supplier=Allied+Electronics; ComponentLink6Description: https://datasheet.ciiva.com/22869/70201119-22869005.pdf?src-supplier=Allied+Electronics; Technology: THICK FILM; Description 1: Res Thick Film 0402 1.47K Ohm 1% 1/16W ±100ppm/°C Molded SMD SMD Paper T/R; Number of Pins: 2; Voltage Rating (DC): 50V; ComponentLink7Description: https://datasheet.ciiva.com/16775/70201119-16775819.pdf?src-supplier=Allied+Electronics; Construction: Rectangular; Category: Chip SMD Resistors; Resistor Type: Thick Film; Source: ICNS_PropheseeLib.SchLib; Series: CRCW; REACH SVHC: Unknown; Resistance Tolerance: 1%; Design Item ID: CRCW04021K47FKED; ComponentLink7URL: https://datasheet.ciiva.com/16775/70201119-16775819.pdf?src-supplier=Allied+Electronics; RoHS Compliant: Yes
R20 = CMP-006-000006-1: Res Thick Film 0402 150K Ohm 1% 1/16W ±100ppm/°C Molded SMD SMD Paper T/R; Manufacturer 1: Vishay; Resistance: 150kR; Voltage Rating (DC): 50V; Max Power Dissipation: 63mW; Case Code (Imperial): 0402; Min Operating Temperature: -55°C; Tolerance: 1%; ComponentLink4URL: https://datasheet.ciiva.com/2463/dcrcwe3-2463137.pdf?src-supplier=Digi-Key; RoHS Compliant: Yes; ComponentLink7URL: https://datasheet.ciiva.com/16207/dcrcwe3-16207433.pdf?src-supplier=Future+Electronics; ComponentLink8Description: https://datasheet.ciiva.com/26316/fld-crcw-e3-data-en-26316632.pdf?src-supplier=Distrelec; Max Operating Temperature: 155°C; Number of Terminations: 2; ComponentLink4Description: https://datasheet.ciiva.com/2463/dcrcwe3-2463137.pdf?src-supplier=Digi-Key; RoHS: Yes; Width: 0.02inch; Termination: SMD/SMT; Resistance Tolerance: 1%; Resistor Type: Thick Film; Radiation Hardening: No; Depth: 0.5mm; Voltage Rating: 50V; Case Code (Metric): 1005; ComponentLink2URL: https://datasheet.ciiva.com/5545/dcrcwe3-109170-5545413.pdf?src-supplier=Mouser; Description 1: Res Thick Film 0402 150K Ohm 1% 1/16W ±100ppm/°C Molded SMD SMD Paper T/R; Packaging: Tape and Reel; Series: CRCW; Temperature Coefficient: 100ppm/°C; Stock 1: 2100; ComponentLink1URL: https://datasheet.ciiva.com/11809/0900766b80d98824-11809905.pdf?src-supplier=RSComponents; Length: 1mm; Pricing 1: 50=0.06100, 500=0.05700, 1000=0.05100, 2000=0.04500, 4000=0.03900 (USD); Construction: Rectangular; ComponentLink2Description: https://datasheet.ciiva.com/5545/dcrcwe3-109170-5545413.pdf?src-supplier=Mouser; Category: Chip SMD Resistors; Package Quantity: 10; Design Item ID: CRCW0402150KFKED; ComponentLink6URL: https://datasheet.ciiva.com/8336/dcrcwe3-8336669.pdf?src-supplier=Avnet; Mount: Surface Mount; Weight: 2.3E-05oz; ComponentLink8URL: https://datasheet.ciiva.com/26316/fld-crcw-e3-data-en-26316632.pdf?src-supplier=Distrelec; Case/Package: 0402; Lead Free: Lead Free; Features: Automotive AEC-Q200; Height: 0.35mm; Contact Plating: Tin; ComponentLink6Description: https://datasheet.ciiva.com/8336/dcrcwe3-8336669.pdf?src-supplier=Avnet; Working Voltage: 50V; ComponentLink1Description: https://datasheet.ciiva.com/11809/0900766b80d98824-11809905.pdf?src-supplier=RSComponents; Power Rating: 63mW; ComponentLink3URL: https://datasheet.ciiva.com/2463/dcrcwe3-2463136.pdf?src-supplier=Digi-Key; Source: ICNS_PropheseeLib.SchLib; REACH SVHC: Unknown; Technology: THICK FILM; ComponentLink3Description: https://datasheet.ciiva.com/2463/dcrcwe3-2463136.pdf?src-supplier=Digi-Key; ComponentLink7Description: https://datasheet.ciiva.com/16207/dcrcwe3-16207433.pdf?src-supplier=Future+Electronics; Military Standard: Not; Manufacturer Part Number 1: CRCW0402150KFKED; ComponentLink5URL: https://datasheet.ciiva.com/2463/dcrcwe3-2463138.pdf?src-supplier=Digi-Key; ComponentLink5Description: https://datasheet.ciiva.com/2463/dcrcwe3-2463138.pdf?src-supplier=Digi-Key
R21 R27 = CMP-006-000015-1: Res Thick Film 0402 165K Ohm 1% 1/16W ±100ppm/°C Molded SMD Paper T/R; Manufacturer 1: Yageo; Max Power Dissipation: 63mW; Voltage Rating: 50V; Power Rating: 62.5mW; Resistance: 165kR; RoHS: Yes; Case/Package: 0402; Case Code (Metric): 1005; Case Code (Imperial): 0402; Min Operating Temperature: -55°C; Max Operating Temperature: 155°C; Tolerance: 1%; Number of Terminations: 2; Temperature Coefficient: 100ppm/°C; Width: 0.02inch; ComponentLink1URL: https://datasheet.ciiva.com/8887/pyu-rc0402-51-rohs-l-6-8887164.pdf?src-supplier=Avnet; ComponentLink1Description: https://datasheet.ciiva.com/8887/pyu-rc0402-51-rohs-l-6-8887164.pdf?src-supplier=Avnet; ComponentLink2URL: https://datasheet.ciiva.com/28393/pyu-rc0402-51-rohs-l-6-28393866.pdf?src-supplier=Avnet+Europe; ComponentLink2Description: https://datasheet.ciiva.com/28393/pyu-rc0402-51-rohs-l-6-28393866.pdf?src-supplier=Avnet+Europe; ComponentLink3URL: https://datasheet.ciiva.com/16869/pyu-rc0402-51-rohs-l-6-16869208.pdf?src-supplier=Avnet+Europe; ComponentLink3Description: https://datasheet.ciiva.com/16869/pyu-rc0402-51-rohs-l-6-16869208.pdf?src-supplier=Avnet+Europe; Manufacturer Part Number 1: RC0402FR-07165KL; Stock 1: 8332; Pricing 1: 1=0.10000, 10=0.01600, 100=0.00660, 1000=0.00299, 2500=0.00259, 5000=0.00214 (USD); Contact Plating: Tin,Matte; Packaging: Tape and Reel; Termination: SMD/SMT; Military Standard: Not; Voltage Rating (DC): 50V; Features: Moisture Resistant; Length: 0.039inch; Height: 0.016inch; Depth: 0.5mm; Lead Free: Lead Free; ComponentLink4URL: https://datasheet.ciiva.com/16744/pyu-rc0402-51-rohs-l-6-r-16744014.pdf?src-supplier=Future+Electronics; ComponentLink4Description: https://datasheet.ciiva.com/16744/pyu-rc0402-51-rohs-l-6-r-16744014.pdf?src-supplier=Future+Electronics; ComponentLink5URL: https://datasheet.ciiva.com/12656/pyu-rc0402-51-rohs-l-6-r-12656760.pdf?src-supplier=Mouser; ComponentLink5Description: https://datasheet.ciiva.com/12656/pyu-rc0402-51-rohs-l-6-r-12656760.pdf?src-supplier=Mouser; Technology: THICK FILM; Design Item ID: RC0402FR-07165KL; Resistor Type: Thick Film; Category: Chip SMD Resistors; Source: ICNS_PropheseeLib.SchLib; RoHS Compliant: Yes; Construction: Rectangular; Description 1: Res Thick Film 0402 165K Ohm 1% 1/16W ±100ppm/°C Molded SMD Paper T/R; Series: RC; Working Voltage: 50V
R22 = CMP-006-000011-1: Res Thick Film 0402 1.2K Ohm 1% 0.2W(1/5W) ±100ppm/°C Pad SMD Automotive T/R; Manufacturer 1: Vishay Dale; Max Power Dissipation: 200mW; Resistance: 1.2kR; Power Rating: 125mW; Voltage Rating: 50V; RoHS: Yes; Mount: Surface Mount; Case/Package: 0402; Case Code (Metric): 1005; Case Code (Imperial): 0402; Min Operating Temperature: -55°C; Max Operating Temperature: 155°C; Tolerance: 1%; Number of Terminations: 2; Temperature Coefficient: 100ppm/°C; Width: 0.02inch; ComponentLink1URL: https://datasheet.ciiva.com/2573/crcwhpe3-2573139.pdf?src-supplier=Digi-Key; ComponentLink1Description: https://datasheet.ciiva.com/2573/crcwhpe3-2573139.pdf?src-supplier=Digi-Key; Manufacturer Part Number 1: CRCW04021K20FKEDHP; Stock 1: 70; Pricing 1: 1=0.15000, 10=0.13200, 100=0.05060, 1000=0.02226, 2500=0.01923, 5000=0.01720 (USD); Contact Plating: Tin; Package Quantity: 10000; Packaging: Tape and Reel; Termination: SMD/SMT; Features: Automotive AEC-Q200; Military Standard: Not; Length: 1mm; Height: 0.016inch; Depth: 0.5mm; Lead Free: Lead Free; Source: ICNS_PropheseeLib.SchLib; Number of Pins: 2; Technology: THICK FILM; Category: Chip SMD Resistors; RoHS Compliant: Yes; Description 1: Res Thick Film 0402 1.2K Ohm 1% 0.2W(1/5W) ±100ppm/°C Pad SMD Automotive T/R; Construction: Rectangular; Series: CRCW-HP; Voltage Rating (DC): 50V; Resistance Tolerance: 1%; Resistor Type: Thick Film; REACH SVHC: Unknown; Design Item ID: CRCW04021K20FKEDHP
R25 = CMP-006-000010-1: Res Thick Film 0402 120K Ohm 1% 0.2W ±100ppm/°C Molded SMD SMD Paper T/R; Manufacturer 1: Vishay Dale; Max Power Dissipation: 200mW; Resistance: 120kR; RoHS: Yes; Mount: Surface Mount; Case/Package: 0402; Min Operating Temperature: -55°C; Max Operating Temperature: 155°C; Tolerance: 1%; Number of Terminations: 2; Temperature Coefficient: 100ppm/°C; Width: 0.02inch; ComponentLink1URL: https://datasheet.ciiva.com/2573/crcwhpe3-2573998.pdf?src-supplier=Digi-Key; ComponentLink1Description: https://datasheet.ciiva.com/2573/crcwhpe3-2573998.pdf?src-supplier=Digi-Key; ComponentLink2URL: https://datasheet.ciiva.com/8975/crcwhpe3-8975274.pdf?src-supplier=Avnet; ComponentLink2Description: https://datasheet.ciiva.com/8975/crcwhpe3-8975274.pdf?src-supplier=Avnet; Manufacturer Part Number 1: CRCW0402120KFKEDHP; Stock 1: 1962; Pricing 1: 1=0.15000, 10=0.13200, 100=0.05060, 1000=0.02226, 2500=0.01923, 5000=0.01720 (USD); Contact Plating: Tin; Features: Automotive AEC-Q200; Package Quantity: 10000; Packaging: Tape and Reel; Length: 0.039inch; Height: 0.016inch; Lead Free: Lead Free; Design Item ID: CRCW0402120KFKEDHP; Source: ICNS_PropheseeLib.SchLib; RoHS Compliant: Yes; Series: CRCW-HP; Radiation Hardening: No; Resistor Type: Thick Film; Category: Chip SMD Resistors; Description 1: Res Thick Film 0402 120K Ohm 1% 0.2W ±100ppm/°C Molded SMD SMD Paper T/R
R26 = CMP-006-000005-1: Res Thick Film 0402 36.5K Ohm 1% 1/16W ±100ppm/°C Molded SMD Automotive AEC-Q200, Moisture Resistant; Manufacturer 1: Yageo; Max Power Dissipation: 63mW; Resistance: 36.5kR; RoHS: Yes; Case/Package: 0402; Min Operating Temperature: -55°C; Max Operating Temperature: 155°C; Tolerance: 1%; Number of Terminations: 2; Temperature Coefficient: 100ppm/°C; Width: 0.02inch; ComponentLink1URL: http://www.yageo.com/NewPortal/yageodocoutput?fileName=/pdf/R-Chip/PYu-AC_51_RoHS_L_6.pdf&src-supplier=Digi-Key; ComponentLink1Description: http://www.yageo.com/NewPortal/yageodocoutput?fileName=/pdf/R-Chip/PYu-AC_51_RoHS_L_6.pdf&src-supplier=Digi-Key; Manufacturer Part Number 1: AC0402FR-0736K5L; Stock 1: 50478; Pricing 1: 1=0.10000, 10=0.02200, 100=0.00900, 1000=0.00402, 2500=0.00349, 5000=0.00288 (USD); Packaging: Tape and Reel; Features: Moisture Resistant,Automotive AEC-Q200; Length: 0.039inch; Height: 0.015inch; Design Item ID: AC0402FR-0736K5L; Resistor Type: Thick Film; Category: Chip SMD Resistors; Source: ICNS_PropheseeLib.SchLib; RoHS Compliant: Yes; Description 1: Res Thick Film 0402 36.5K Ohm 1% 1/16W ±100ppm/°C Molded SMD
R30 = CMP-006-000003-1: Res Thick Film 0402 52.3K Ohm 1% 0.2W(1/5W) ±100ppm/°C Automotive AEC-Q200, Pulse Withstanding; Manufacturer 1: Vishay Dale; Max Power Dissipation: 200mW; Resistance: 52.3kR; Description 1: RES SMD 52.3K OHM 1% 1/5W 0402; RoHS: Yes; Case/Package: 0402; Min Operating Temperature: -55°C; Max Operating Temperature: 155°C; Tolerance: 1%; Number of Terminations: 2; Temperature Coefficient: 100ppm/°C; Width: 0.02inch; ComponentLink1URL: http://www.vishay.com/docs/20065/rcse3.pdf?src-supplier=Digi-Key; ComponentLink1Description: http://www.vishay.com/docs/20065/rcse3.pdf?src-supplier=Digi-Key; Manufacturer Part Number 1: RCS040252K3FKED; Stock 1: 9749; Pricing 1: 1=0.12000, 10=0.10500, 100=0.04020, 1000=0.01771, 2500=0.01530, 5000=0.01368 (USD); Package Quantity: 10000; Packaging: Tape and Reel; Features: Automotive AEC-Q200; Length: 0.039inch; Height: 0.016inch; Design Item ID: RCS040252K3FKED; Source: ICNS_PropheseeLib.SchLib; Resistor Type: Thick Film; RoHS Compliant: Yes; Category: Chip SMD Resistors